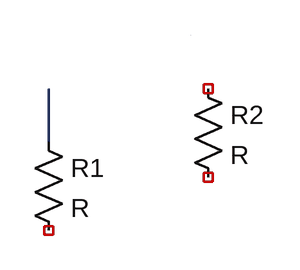
[diagram p0: schematic Draft1.asc]
Draft1.asc, the LTspice schematic file:
Version 4
SHEET 1 880 680
WIRE -128 96 -128 48
WIRE 0 0 0 0
SYMBOL res -144 80 R0
SYMATTR InstName R1
SYMBOL res 0 32 R0
SYMATTR InstName R2

The netlist it stands for:
* Draft1.asc
R1 N001 NC_01 R
R2 NC_02 NC_03 R
.backanno
.end